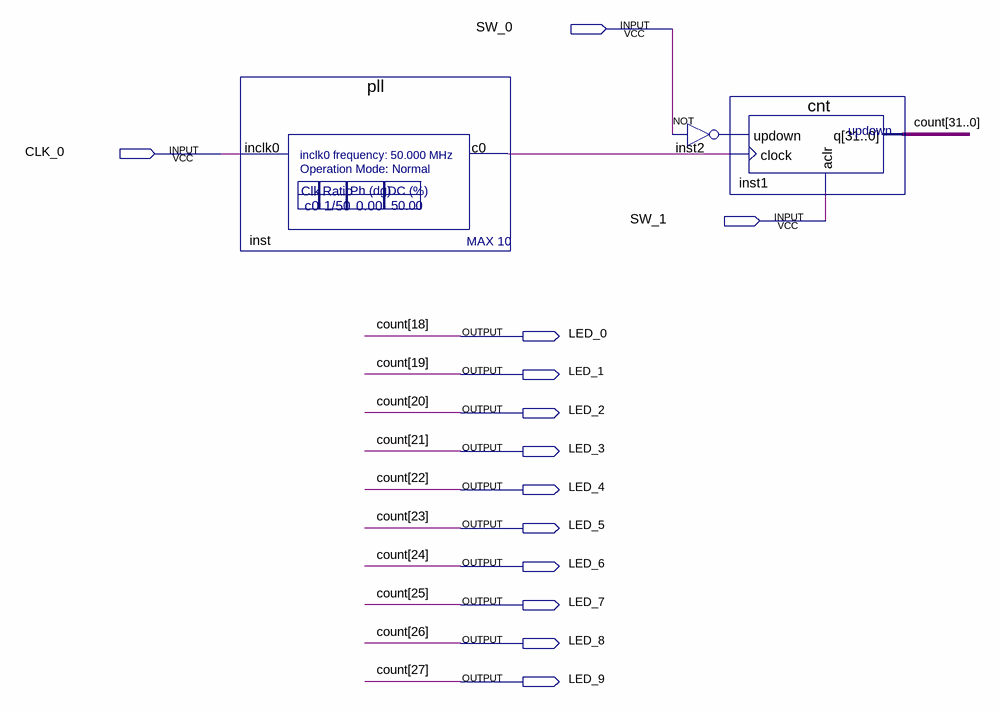
[diagram p0: schematic sheet]
// Quartus schematic binary_counter.bdf as structural Verilog: 3 symbols, 13 pins
module binary_counter (
  input  SW_0,
  input  CLK_0,
  input  SW_1,
  output LED_0,
  output LED_1,
  output LED_2,
  output LED_3,
  output LED_4,
  output LED_5,
  output LED_6,
  output LED_7,
  output LED_8,
  output LED_9
);

  wire inst2_out, inst_c0;
  wire [31:0] count;

  pll inst (.inclk0(CLK_0), .c0(inst_c0));
  cnt inst1 (
    .updown(inst2_out), .clock(inst_c0), .aclr(SW_1),
    .q({count[31:28], LED_9, LED_8, LED_7, LED_6, LED_5, LED_4, LED_3, LED_2, LED_1, LED_0, count[17:0]}));
  not inst2 (inst2_out, SW_0);

  // Other names for the same wires on the sheet: count[27:18] = {LED_9, LED_8, LED_7, LED_6, LED_5, LED_4, LED_3, LED_2, LED_1, LED_0}
endmodule
